# Altium schematic sheet Current_Voltage_Sensor.SchDoc: Current_Voltage_Sensor
size Letter; Author: Nicholas J. Sorensen, and Erik F. Halliwell; Engineer: Nicholas J. Sorensen, and Erik F. Halliwell; DocumentNumber: 3; SheetNumber: 3; SheetTotal: 8
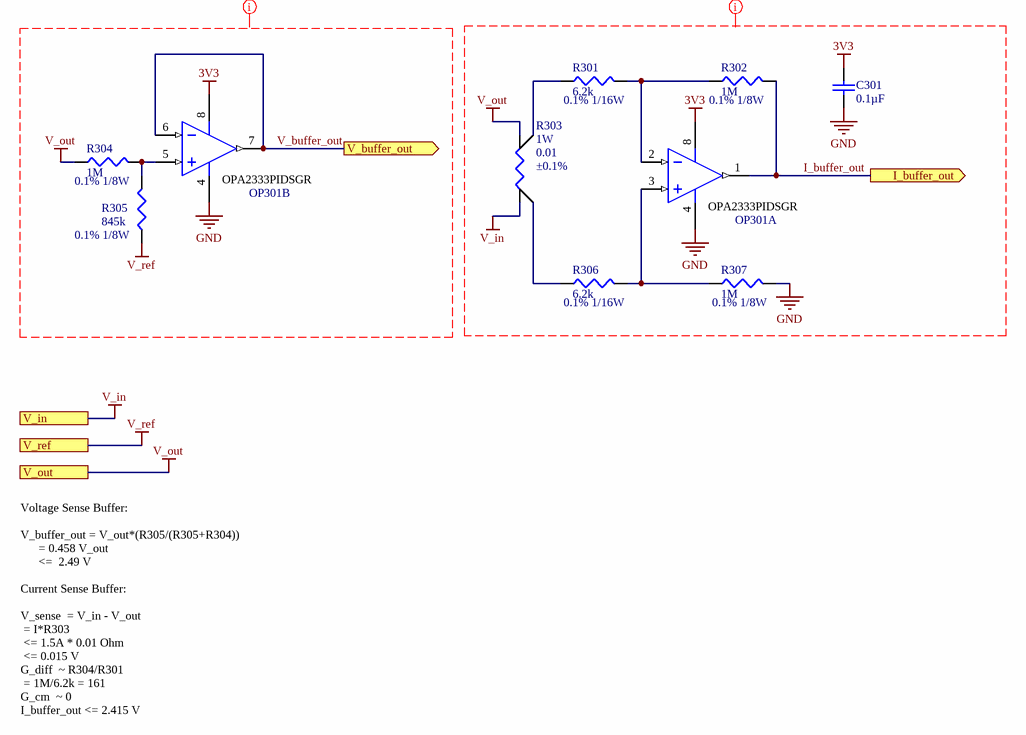
[diagram p0: Current_Voltage_Sensor.SchDoc]

## Parts
C301  value 0.1µF  [TDK-CGA2B]  (hidden comment: Cap)
OP301  OPA2333  [TI-DSG0008A]  (value not drawn)  (parts A,B of 2)
R301  0.1% 1/16W  value 6.2k  [PANA-ERA2A]
R302  0.1% 1/8W  value 1M  [PANA-ERA6A]
R303  value 0.01  Power - Rated: 1W  Tolerance: ±0.1%  [VSH-2512R4C]  (hidden comment: Res Sense)
R304  0.1% 1/8W  value 1M  [PANA-ERA6A]
R305  0.1% 1/8W  value 845k  [PANA-ERA6A]
R306  0.1% 1/16W  value 6.2k  [PANA-ERA2A]
R307  0.1% 1/8W  value 1M  [PANA-ERA6A]

## Ports
I_buffer_out (out), V_buffer_out (out), V_in, V_out, V_ref

## Nets
3V3: C301.2 OP301.8(V+)
GND: C301.1 OP301.4(V-) R307.2
V_in: R303.1(I1) ; port V_in
V_out: R303.2(I2) R304.1 ; port V_out
V_ref: R305.1 ; port V_ref
I_buffer_out: OP301.1(OUT) R302.2 ; port I_buffer_out
V_buffer_out: OP301.6(IN-) OP301.7(OUT) ; port V_buffer_out
NetOP301_2: OP301.2(IN-) R301.2 R302.1
NetOP301_3: OP301.3(IN+) R306.2 R307.1
NetOP301_5: OP301.5(IN+) R304.2 R305.2
NetR301_1: R301.1 R303.3(S2)
NetR303_4: R303.4(S1) R306.1

## Layout directives
mark named Current Sense Buffer: 3V3, GND, I_buffer_out, V_in, V_out
mark named Voltage Sense Buffer: (no net found under the mark)

## Notes on the sheet
- (near OP301) OPA2333PIDSGR
- Voltage Sense Buffer:
  V_buffer_out = V_out*(R305/(R305+R304))
  = 0.458 V_out
  <=  2.49 V
  Current Sense Buffer:
  V_sense 	= V_in - V_out
  = I*R303
  <= 1.5A * 0.01 Ohm
  <= 0.015 V
  G_diff 	~ R304/R301
  = 1M/6.2k = 161
  G_cm 	~ 0
  I_buffer_out <= 2.415 V
- (the "License"); you may not use or redistribute this file except in compliance with the License. You
- This file and the information within it are licensed under the terms of the Apache License, Version 2.0
- Copyright
- Unless required by applicable law or agreed to in writing, content distributed under the License is
- distributed on an "AS IS" BASIS, WITHOUT WARRANTIES OR CONDITIONS OF ANY KIND,
- either express or implied. See the License for the specific language governing permissions and
- limitations under the License.
- may obtain a copy of the License at:
- http://www.apache.org/licenses/LICENSE-2.0
- Title
- Size:
- Date:
- Letter
- Number:
- Time:
- Revision:
- Sheet
- of
- University of Alberta
- Deptartment of Electrical
- and Computer Engineering
- Edmonton AB, Canada
- T6G 1H9
- File:

## Library data of the parts
C301 = PC-TDK-02255: CAP CER 0.1UF 35V X7R 0402; Manufacturer Part Number: CGA2B3X7R1V104K050BB; Index: 2255; Designator: C?; Tolerance: ±10%; Published: 2016-03-16; LatestRevisionDate: 2016-03-16; LatestRevisionNote: ...; PackageReference: 0402 (1005 Metric); Publisher: AlbertaSat; PackageDescription: Radial Cap, Thru-Hole; 2 Leads; 0.3 in Pin Spacing; Part Number: PC-TDK-02255; Supplier Part Number 1: 445-6901-1-ND; Supplier 1: Digi-key; Supplier Link: http://www.digikey.ca/product-search/en?keywords=445-6901-1-ND; Voltage - Rated: 35V; Temperature Coefficient: X7R; Applications: Automotive
OP301 = 73: CMOS Amplifier 2 Circuit Rail-to-Rail 8-WSON (2x2); Part Number: 73; Manufacturer Part Number: OPA2333PIDSGR; Designator: U?; Voltage - Supply: 1.8V ~ 5.5V, ±0.9V ~ 2.75V; Supplier Part Number 2: 595-OPA2333PIDSGR; Supplier 2: Mouser; Supplier Part Number 1: 296-51501-1-ND; Supplier 1: Digi-Key; Supplier Link: #https://www.digikey.ca/product-detail/en/texas-instruments/OPA2333PIDSGR/296-51501-1-ND/9745865#; PackageReference: 8-WFDFN Exposed Pad; Operating Temperature: -55°C ~ 150°C
R301 R306 = 16853: RES SMD 6.2K OHM 0.1% 1/16W 0402; Part Number: 16853; Manufacturer Part Number: ERA-2APB622X; Designator: R?; Power: 0.063W, 1/16W; Temperature Coefficient: ±15ppm/°C; Published: 8-Jun-2000; LatestRevisionDate: 29-May-2009; LatestRevisionNote: IPC-7351 Footprint Added.; PackageReference: 0402 (1005 Metric); Publisher: Altium Limited; PackageDescription: Chip Resistor, 2-Leads, Body 1.00x0.50mm, IPC Low Density; Supplier Part Number 1: P6.2KCNCT-ND; Supplier 1: Digi-Key; Supplier Link: http://www.digikey.ca/product-search/en?keywords=P6.2KCNCT-ND; Tolerance: ±0.1%
R302 R304 R307 = 19706: RES SMD 1M OHM 0.1% 1/8W 0805; Part Number: 19706; Manufacturer Part Number: ERA-6AEB105V; Designator: R?; Power: 0.125W, 1/8W; Temperature Coefficient: ±25ppm/°C; Published: 8-Jun-2000; LatestRevisionDate: 29-May-2009; LatestRevisionNote: IPC-7351 Footprint Added.; PackageReference: 0805 (2012 Metric); Publisher: Altium Limited; PackageDescription: Chip Resistor, 2-Leads, Body 2.00x1.25mm, IPC Low Density; Supplier Part Number 1: P1MDACT-ND; Supplier 1: Digi-Key; Supplier Link: http://www.digikey.ca/product-search/en?keywords=P1MDACT-ND; Tolerance: ±0.1%
R303 = PR-VSH-00237: RES SMD 0.01 OHM 0.1% 1W 2512; Manufacturer Part Number: Y14870R01000B9W; Index: 237; Designator: R?; Temperature Coefficient: ±15ppm/°C; Part Number: PR-VSH-00237; Supplier Part Number 1: Y1487-.01-ND; Supplier 1: Digi-key; Publisher: AlbertaSat; Published: 2017-07-12; LatestRevisionDate: 2017-07-12; LatestRevisionNote: ...; PackageReference: VSH-2512R4C; Supplier Link: http://www.digikey.ca/product-search/en?keywords=Y1487-.01-ND; Applications: Automotive
R305 = 19643: RES SMD 845K OHM 0.1% 1/8W 0805; Part Number: 19643; Manufacturer Part Number: ERA-6AEB8453V; Designator: R?; Power: 0.125W, 1/8W; Temperature Coefficient: ±25ppm/°C; Published: 8-Jun-2000; LatestRevisionDate: 29-May-2009; LatestRevisionNote: IPC-7351 Footprint Added.; PackageReference: 0805 (2012 Metric); Publisher: Altium Limited; PackageDescription: Chip Resistor, 2-Leads, Body 2.00x1.25mm, IPC Low Density; Supplier Part Number 1: P845KDACT-ND; Supplier 1: Digi-Key; Supplier Link: http://www.digikey.ca/product-search/en?keywords=P845KDACT-ND; Tolerance: ±0.1%